# EAGLE design pavapro3c (EAGLE 6.4)
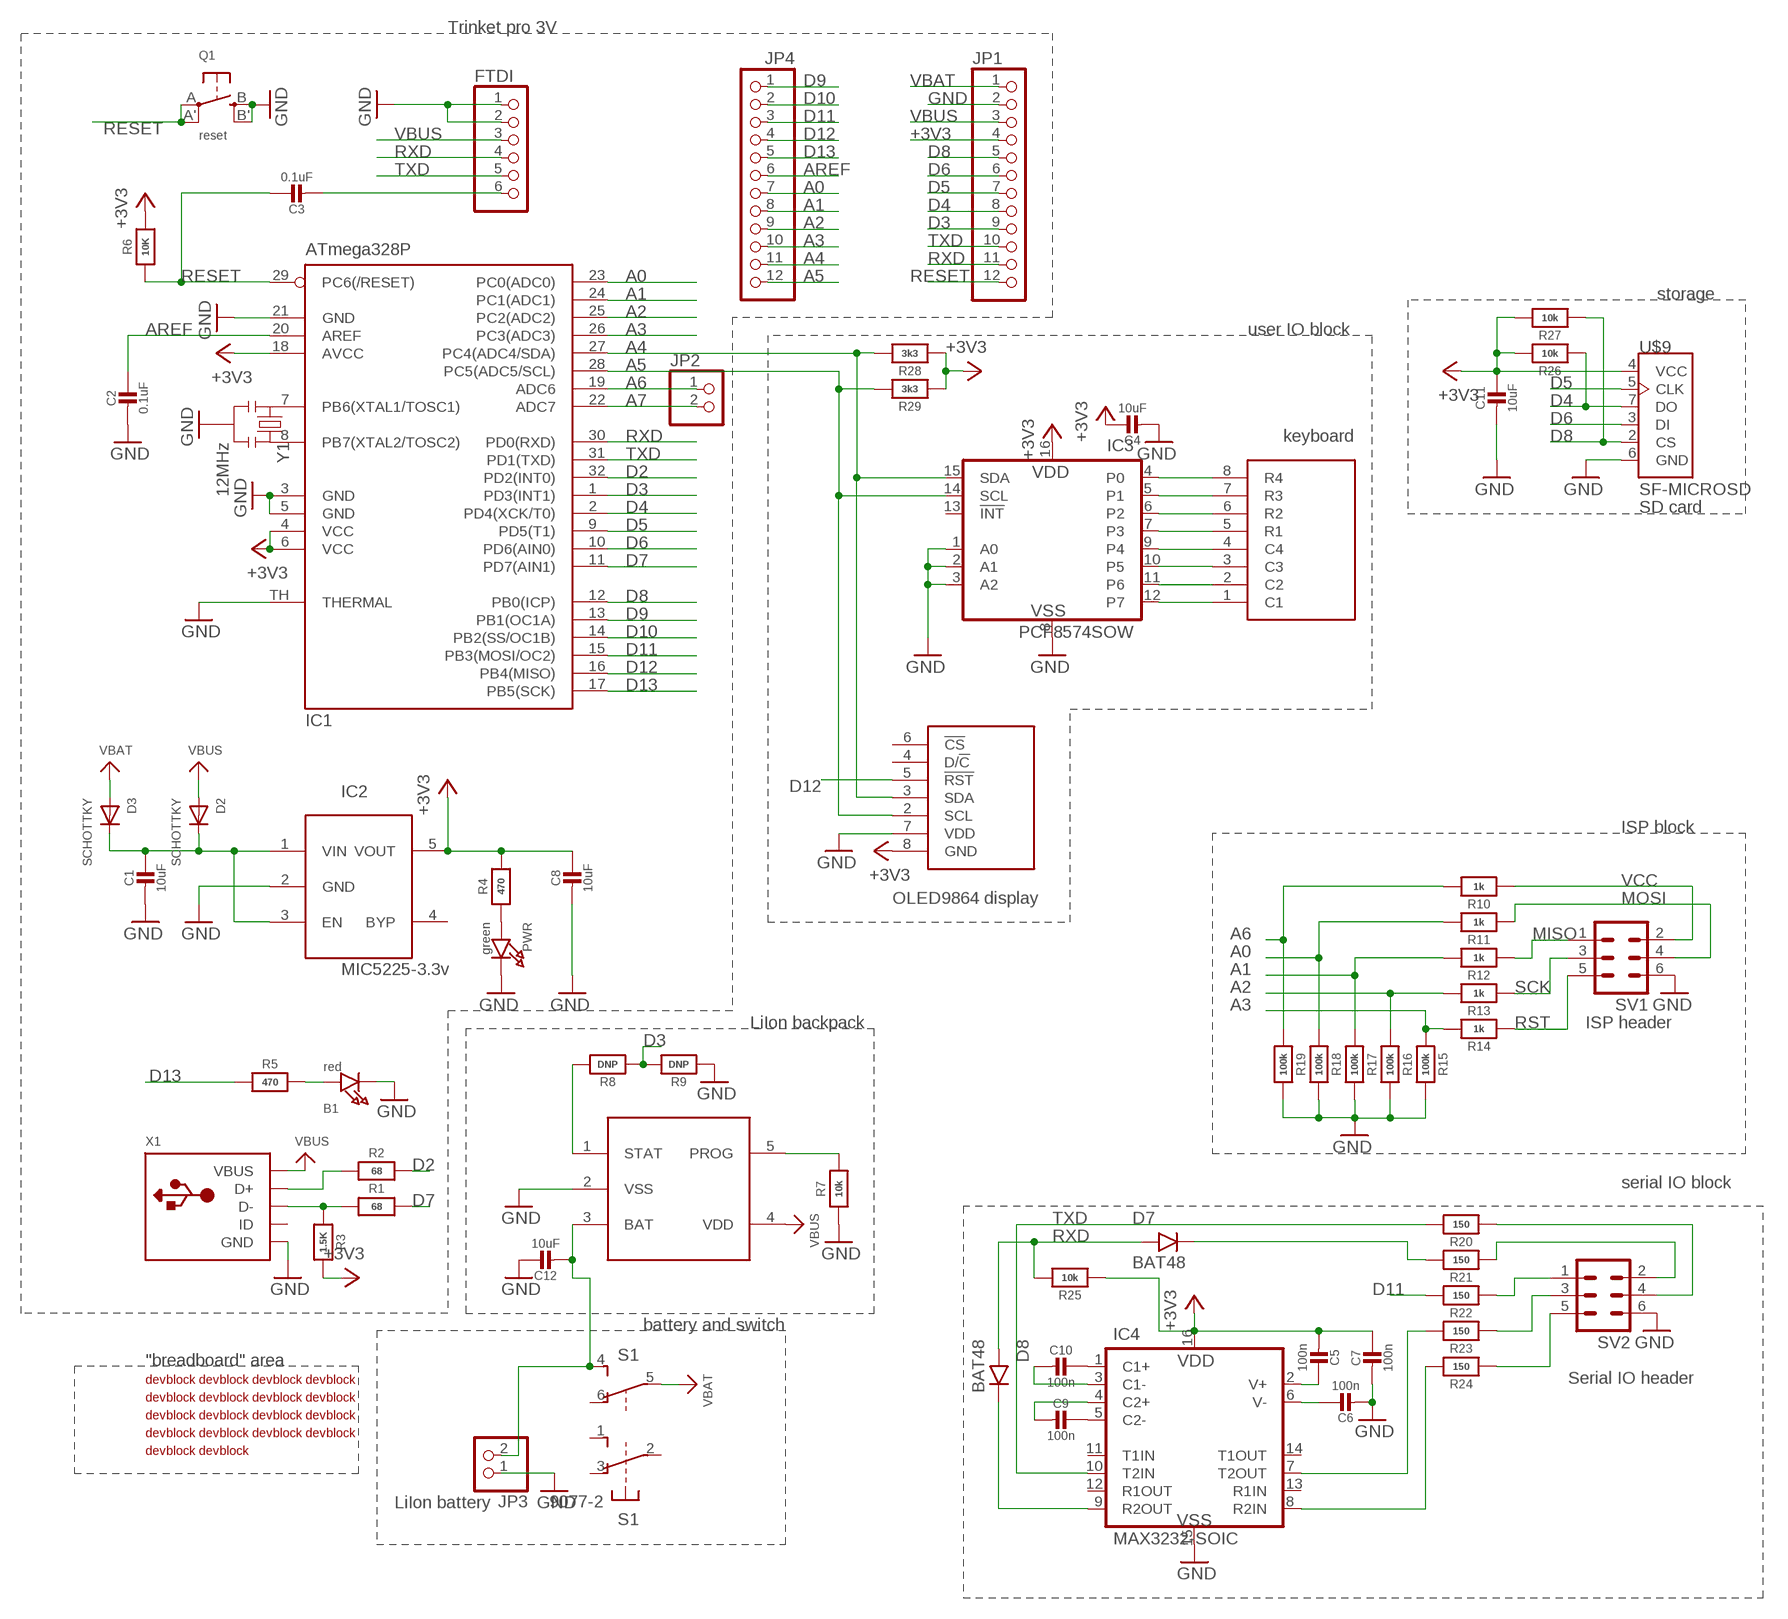
[diagram p0: schematic, sheet 1]

## Parts
B1  red  LED0805_NOOUTLINE  [CHIPLED_0805_NOOUTLINE]
C1  10uF  CAP_CERAMIC0805-NOOUTLINE  [0805-NO]
C2  0.1uF  CAP_CERAMIC_0805MP  [_0805MP]
C3  0.1uF  CAP_CERAMIC0805-NOOUTLINE  [0805-NO]
C4  10uF  CAP_CERAMIC0805-NOOUTLINE  [0805-NO]
C5  100n  CAP_CERAMIC0805-NOOUTLINE  [0805-NO]
C6  100n  CAP_CERAMIC0805-NOOUTLINE  [0805-NO]
C7  100n  CAP_CERAMIC0805-NOOUTLINE  [0805-NO]
C8  10uF  CAP_CERAMIC0805-NOOUTLINE  [0805-NO]
C9  100n  CAP_CERAMIC0805-NOOUTLINE  [0805-NO]
C10  100n  CAP_CERAMIC0805-NOOUTLINE  [0805-NO]
C11  10uF  CAP_CERAMIC0805-NOOUTLINE  [0805-NO]
C12  10uF  CAP_CERAMIC0805-NOOUTLINE  [0805-NO]
D2  SCHOTTKY  ADAFRUIT_DIODE_SOD-123FL  [ADAFRUIT_SOD-123FL]
D3  SCHOTTKY  ADAFRUIT_DIODE_SOD-123FL  [ADAFRUIT_SOD-123FL]
D7  BAT48  1N4148SOD  [SOD-80]
D8  BAT48  1N4148SOD  [SOD-80]
FTDI  ADAFRUIT_PINHD-1X6CB  [ADAFRUIT_1X06-CLEANBIG]
IC1  ATmega328P  MEGA8-MI  [MLF32-TH]
IC2  MIC5225-3.3v  LP298XS  [SOT23-5L]
IC3  PCF8574SOW  [SO-16DW]
IC4  MAX3232-SOIC  [SO-16]
JP1  ADAFRUIT_PINHD-1X12-CB  [ADAFRUIT_1X12-CB]
JP2  HEADER-1X2ROUND  [1X02_ROUND]
JP3  PINHD-1X02_2.54-90°  [1X02/90]
JP4  ADAFRUIT_PINHD-1X12-CB  [ADAFRUIT_1X12-CB]
PWR  green  LED0805_NOOUTLINE  [CHIPLED_0805_NOOUTLINE]
Q1  reset  SWITCH_TACT_SMT4.6X2.8  [BTN_KMR2_4.6X2.8]
R1  68  RESISTOR_0603_NOOUT  [0603-NO]
R2  68  RESISTOR_0603_NOOUT  [0603-NO]
R3  1.5K  RESISTOR_0603_NOOUT  [0603-NO]
R4  470  RESISTOR_0603_NOOUT  [0603-NO]
R5  470  RESISTOR_0603_NOOUT  [0603-NO]
R6  10K  RESISTOR0805_NOOUTLINE  [0805-NO]
R7  10k  RESISTOR_0805  [_0805]
R8  DNP  RESISTOR_0805  [_0805]
R9  DNP  RESISTOR_0805  [_0805]
R10  1k  RESISTOR_0805  [_0805]
R11  1k  RESISTOR_0805  [_0805]
R12  1k  RESISTOR_0805  [_0805]
R13  1k  RESISTOR_0805  [_0805]
R14  1k  RESISTOR_0805  [_0805]
R15  100k  RESISTOR_0805  [_0805]
R16  100k  RESISTOR_0805  [_0805]
R17  100k  RESISTOR_0805  [_0805]
R18  100k  RESISTOR_0805  [_0805]
R19  100k  RESISTOR_0805  [_0805]
R20  150  RESISTOR_0805  [_0805]
R21  150  RESISTOR_0805  [_0805]
R22  150  RESISTOR_0805  [_0805]
R23  150  RESISTOR_0805  [_0805]
R24  150  RESISTOR_0805  [_0805]
R25  10k  RESISTOR_0805  [_0805]
R26  10k  RESISTOR_0805  [_0805]
R27  10k  RESISTOR_0805  [_0805]
R28  3k3  RESISTOR_0805  [_0805]
R29  3k3  RESISTOR_0805  [_0805]
S1  9077-2  [9077-2]
SV1  ML6  [ML6]
SV2  ML6  [ML6]
U$5  DISP_OLED_2864  [OLED2864]
U$6  MCP73831  [SOT23-5]
U$7  KB1604  [KB1604]
U$9  SF-MICROSD  [MICROSD]
U$10  DEVBLOCK_1_16  [DEVBLOCK_1_16]
U$11  DEVBLOCK_1_16  [DEVBLOCK_1_16]
U$12  DEVBLOCK_1_16  [DEVBLOCK_1_16]
U$13  DEVBLOCK_1_16  [DEVBLOCK_1_16]
U$14  DEVBLOCK_1_16  [DEVBLOCK_1_16]
U$15  DEVBLOCK_1_16  [DEVBLOCK_1_16]
U$16  DEVBLOCK_1_16  [DEVBLOCK_1_16]
U$17  DEVBLOCK_1_16  [DEVBLOCK_1_16]
U$18  DEVBLOCK_1_16  [DEVBLOCK_1_16]
U$19  DEVBLOCK_1_16  [DEVBLOCK_1_16]
U$20  DEVBLOCK_1_16  [DEVBLOCK_1_16]
U$21  DEVBLOCK_1_16  [DEVBLOCK_1_16]
U$22  DEVBLOCK_1_16  [DEVBLOCK_1_16]
U$23  DEVBLOCK_1_16  [DEVBLOCK_1_16]
U$24  DEVBLOCK_1_16  [DEVBLOCK_1_16]
U$25  DEVBLOCK_1_16  [DEVBLOCK_1_16]
U$26  DEVBLOCK_1_16  [DEVBLOCK_1_16]
U$27  DEVBLOCK_1_16  [DEVBLOCK_1_16]
X1  MICROBUILDER_USBMICRO_20329  [MICROBUILDER_4UCONN_20329]
Y1  12MHz  RESONATORSMD  [RESONATOR-SMD]

## Nets
+3V3: C4.1 C5.2 C7.1 C8.1 C11.1 IC1.4(VCC) IC1.6(VCC) IC1.18(AVCC) IC2.5(VOUT) IC3.16(VDD) IC4.16(VDD) JP1.4 R3.2 R4.2 R6.2 R25.2 R26.1 R27.1 R28.2 R29.2 U$5.8(GND) U$9.4(VCC)
A0: IC1.23(PC0(ADC0)) JP4.7 R11.1 R18.2
A1: IC1.24(PC1(ADC1)) JP4.8 R12.1 R17.2
A2: IC1.25(PC2(ADC2)) JP4.9 R13.1 R16.2
A3: IC1.26(PC3(ADC3)) JP4.10 R14.1 R15.2
A4: IC1.27(PC4(ADC4/SDA)) IC3.15(SDA) JP4.11 R28.1 U$5.3(SDA)
A5: IC1.28(PC5(ADC5/SCL)) IC3.14(SCL) JP4.12 R29.1 U$5.2(SCL)
A6: IC1.19(ADC6) JP2.1 R10.1 R19.2
A7: IC1.22(ADC7) JP2.2
AREF: C2.1 IC1.20(AREF) JP4.6
D2: IC1.32(PD2(INT0)) R2.2
D3: IC1.1(PD3(INT1)) JP1.9 R8.2 R9.1
D4: IC1.2(PD4(XCK/T0)) JP1.8 R26.2 U$9.7(DO)
D5: IC1.9(PD5(T1)) JP1.7 U$9.5(CLK)
D6: IC1.10(PD6(AIN0)) JP1.6 U$9.3(DI)
D7: IC1.11(PD7(AIN1)) R1.2
D8: IC1.12(PB0(ICP)) JP1.5 R27.2 U$9.2(CS)
D9: IC1.13(PB1(OC1A)) JP4.1
D10: IC1.14(PB2(SS/OC1B)) JP4.2
D11: IC1.15(PB3(MOSI/OC2)) JP4.3 R22.1
D12: IC1.16(PB4(MISO)) JP4.4 U$5.5(!RST)
D13: IC1.17(PB5(SCK)) JP4.5 R5.2
D+: R2.1 X1.D+
D-: R1.1 R3.1 X1.D-
DTR/RTS: C3.2 FTDI.6
GND: B1.C C1.2 C2.2 C4.2 C6.2 C7.2 C8.2 C11.2 C12.1 FTDI.1 FTDI.2 IC1.3(GND) IC1.5(GND) IC1.21(GND) IC1.TH(THERMAL) IC2.2(GND) IC3.1(A0) IC3.2(A1) IC3.3(A2) IC3.8(VSS) IC4.15(VSS) JP1.2 JP3.1 PWR.C Q1.B'(S1) Q1.B(S) R7.2 R9.2 R15.1 R16.1 R17.1 R18.1 R19.1 SV1.6 SV2.6 U$5.7(VDD) U$6.2(VSS) U$9.6(GND) X1.BASE@1(GND) X1.BASE@2(GND) X1.GND X1.SPRT@1(GND) X1.SPRT@2(GND) X1.SPRT@3(GND) X1.SPRT@4(GND) Y1.2
MISO: R12.2 SV1.1
MOSI: R11.2 SV1.4
N$1: B1.A R5.1
N$2: IC1.8(PB7(XTAL2/TOSC2)) Y1.3
N$3: IC1.7(PB6(XTAL1/TOSC1)) Y1.1
N$6: PWR.A R4.1
N$7: C1.1 D2.C D3.C IC2.1(VIN) IC2.3(EN)
N$8: IC3.12(P7) U$7.1(C1)
N$9: IC3.11(P6) U$7.2(C2)
N$10: IC3.10(P5) U$7.3(C3)
N$11: IC3.9(P4) U$7.4(C4)
N$16: IC3.7(P3) U$7.5(R1)
N$17: IC3.6(P2) U$7.6(R2)
N$18: IC3.5(P1) U$7.7(R3)
N$19: IC3.4(P0) U$7.8(R4)
N$20: C12.2 JP3.2 S1.4(2:S) U$6.3(BAT)
N$26: R7.1 U$6.5(PROG)
N$28: R8.1 U$6.1(STAT)
N$37: R20.2 SV2.4
N$38: R21.2 SV2.2
N$39: R22.2 SV2.1
N$40: R23.2 SV2.3
N$41: R24.2 SV2.5
N$43: IC4.7(T2OUT) R23.1
N$44: D7.K R21.1
N$45: D8.K IC4.9(R2OUT)
N$47: C6.1 IC4.6(V-)
N$48: C5.1 IC4.2(V+)
N$50: C9.1 IC4.5(C2-)
N$51: C10.1 IC4.1(C1+)
N$52: C10.2 IC4.3(C1-)
N$53: C9.2 IC4.4(C2+)
N$54: IC4.8(R2IN) R24.1
RESET: C3.1 IC1.29(PC6(/RESET)) JP1.12 Q1.A'(P1) Q1.A(P) R6.1
RST: R14.2 SV1.5
RXD: D7.A D8.A FTDI.4 IC1.30(PD0(RXD)) JP1.11 R25.1
SCK: R13.2 SV1.3
TXD: FTDI.5 IC1.31(PD1(TXD)) IC4.10(T2IN) JP1.10 R20.1
VBAT [power]: D3.A JP1.1 S1.5(2:P)
VBUS: D2.A FTDI.3 JP1.3 U$6.4(VDD) X1.VBUS
VCC: R10.2 SV1.2
Unconnected: IC2.4(BYP) IC3.13(!INT) IC4.11(T1IN) IC4.12(R1OUT) IC4.13(R1IN) IC4.14(T1OUT) S1.1(1:S) S1.2(1:P) S1.3(1:O) S1.6(2:O) U$5.4(D/!C) U$5.6(!CS) X1.ID

## Notes on the sheet
- Trinket pro 3V
- storage
- user IO block
- keyboard
- SD card
- ISP block
- OLED9864 display
- LiIon backpack | ISP header
- serial IO block
- battery and switch
- "breadboard" area
- Serial IO header
- LiIon battery

## Library data of the parts
B1 PWR = microbuilder:LED: LED 0603 - 0603 Surface Mount Package 2mA: Green LED - Low Power (3.9mcd, 2ma, 1.7Vf) - Digikey: 475-2709-2-ND Orange LED - Low Power (9.8mcd, 2ma, 1.8Vf) - Digikey: 475-1194-2-ND Red LED - Low Power (5mcd, 2ma, 1.8Vf) - Digikey: 475-1195-2-ND Yellow LED - Low Power (7mcd, 2ma, 1.8Vf) - Digikey: 475-1196-2-ND 5mA: Blue LED - Low Power (17mcd, 5ma, 2.9Vf) - Digikey: LNJ937W8CRACT-ND 0805 - 0805 Surface Mount Package 2mA: Red LED (8.8mcd, 2mA, 1.8Vf, Clear) - Low Power [Digikey: 475-2510-1-ND] Green LED (5mcd, 2mA, 1.8Vf, Clear) - Low Power [Digikey: 475-2730-1-ND] Yellow LED (11.3mcd, 2mA, 1.8Vf, Clear) - Low Power [Digikey: 475-2555-1-ND] 20mA: Red LED (104mcd, 20mA, Diffused) - LS R976 [Digikey: 475-1278-6-ND] Red LED (12mcd, 20mA, 2.0Vf, Clear) - APT2012EC [Digikey: 754-1128-1-ND] Green LED (15mcd, 20mA, 2.2Vf, Clear) - APT2012GC [Digikey: 754-1131-1-ND] Orange LED (160mcd, 20mA, 2.1Vf, Clear) - APT2012SECK [Digikey: 754-1130-1-ND] 1206 - 1206 Surface Mount Package Green LED (26mcd, 20mA, Diffused) - LG N971 [Digikey: 475-1407-6-ND] Red LED (15mcd, 20mA, Diffused) - LH N974 [Digikey: 475-1416-6-ND] Cree - Cree High-Power Surface Mount LEDs XPEBWT-L1-0000-00D50 - White 111lm 350mA 2.9Vf 6200K 110° XTEAWT-00-0000-00000LEE3 - White 114lm 350mA 2.85Vf 5000K 115° Everlight - Everlight 45-21 Series Surface Mount LEDs 45-21/QK2C-B2832AC2CB2/2T - Warm White 2000mcd 20mA 3.25Vf 3050K 120° 45-21/LK2C-B38452C4CB2/2T - Nuetral White 2000mcd 20mA 3.25Vf 4150K 120° 45-21/LK2C-B50634C6CB2/2T - Cold White 2200mcd 20mA 3.25Vf 5650K 120° PLCC2 Reverse Mount LS T77K-J1L2-1-0-2-R18-Z - Red 11.25mcd 2mA 1.8Vf 630nm 120° LO T77K-L1M2-24-Z - Orange 19.6mcd 2mA 1.8Vf 606nm 120° LY T77K-K2M1-26-Z - Yellow 15.7mcd 2mA 1.8Vf 587nm 120°
C1-C12 = microbuilder:CAP_CERAMIC: Ceramic Capacitors For new designs, use the packages preceded by an '_' character since they are more reliable: The following footprints should be used on most boards: _0402 - Standard footprint for regular board layouts _0603 - Standard footprint for regular board layouts _0805 - Standard footprint for regular board layouts _1206 - Standard footprint for regular board layouts For extremely tight-pitch boards where space is at a premium, the following 'micro-pitch' footprints can be used (smaller pads, no silkscreen outline, etc.): _0402MP - Micro-pitch footprint for very dense/compact boards _0603MP - Micro-pitch footprint for very dense/compact boards _0805MP - Micro-pitch footprint for very dense/compact boards _1206MP - Micro-pitch footprint for very dense/compact boards
D2 D3 = Adafruit Pro Trinket 3v3:ADAFRUIT_DIODE: Diode SMADIODE - SMA Surface Mount Package 20V 1A Schottky Diode Digikey: 641-1014-6-ND DO-1N4148 - Through Hole Small Current Diode SOD-123 20V 1 A (.5mV Vf) Schottky Diode - Digikey: MBRX120TPMSCT-ND SOD-323 10V 570mA (.38mV Vf, 3ns) Schottky Diode - Digikey: ZLLS410CT-ND SOD-523 30V 30mA Schottky Diode (RB751S-40TE61) - Digikey: RB751S-40TE61CT-ND SOT23-R/W - SOT23 Package (R = Solder Paste/Reflow Ovens, W = Hand-Soldering) BAT54Film 40V 300mA - Digikey: 497-7162-1-ND
D7 D8 = _mcom5:1N4148
FTDI = Adafruit Pro Trinket 3v3:ADAFRUIT_PINHD-1X6: PIN HEADER
IC1 = microbuilder:MEGA8-MI: MICROCONTROLLER 8 Kbytes FLASH, 1 kbytes SRAM, 512 bytes EEPROM, USART, 6-channel 10 bit ADC, 2-channel 8 bit ADC Pin compatible with Atmega48, ATMega88, ATMega168 Source: avr.lbr; MPN: ATMEGA88PA-MU; OC_FARNELL: 1715491; OC_NEWARK: 15R0272
IC2 = adafruit:LP298X
IC3 = _mcom5:PCF8574
IC4 = _mcom5:MAX3232
JP1 JP4 = Adafruit Pro Trinket 3v3:ADAFRUIT_PINHD-1X12: PIN HEADER
JP2 = microbuilder:HEADER-1X2: PIN HEADER
JP3 = pinhead-2:PINHD-1X02: PIN HEADER
Q1 = microbuilder:SWITCH_TACT_SMT: SMT Tact Switches 6x6mm - Digikey: P12940SCT-ND KMR2 (4.6x2.8mm) - Digikey: 401-1426-1-ND EVQ-PQHB55 - Light Touch, 160GF (4.5x4.5mm) - Digikey: P8090SCT-ND KMT0 - KMT021 NGJ LHS (etc.) IP68/Waterproof - Digikey: CKN10289CT-ND
R1-R29 = microbuilder:RESISTOR: Resistors For new designs, use the packages preceded by an '_' character since they are more reliable: The following footprints should be used on most boards: _0402 - Standard footprint for regular board layouts _0603 - Standard footprint for regular board layouts _0805 - Standard footprint for regular board layouts _1206 - Standard footprint for regular board layouts For extremely tight-pitch boards where space is at a premium, the following 'micro-pitch' footprints can be used (smaller pads, no silkscreen outline, etc.): _0402MP - Micro-pitch footprint for very dense/compact boards _0603MP - Micro-pitch footprint for very dense/compact boards _0805MP - Micro-pitch footprint for very dense/compact boards _1206MP - Micro-pitch footprint for very dense/compact boards
S1 = switch-misc:9077-2: MARQUARDT SWITCH
SV1 SV2 = con-harting-ml:ML6: HARTING
U$5 = _moja:DISP_OLED_2864
U$6 = _moja:MCP73831
U$7 = _moja:KB1604
U$9 = microsd:SF-MICROSD
U$10-U$27 = _moja:DEVBLOCK
X1 = Adafruit Pro Trinket 3v3:MICROBUILDER_USB: USB Connectors USBMINIB - Surface Mount Female Mini-B USB Connector 4UConnector: 06564
Y1 = SparkFun:RESONATOR: Resonator Small SMD resonator. This is the itty bitty 10/20MHz resonators with built in caps. CSTCE10M0G55 and CSTCE20M0V53. Footprint has been reviewed closely but hasn't been tested yet.

## Net classes
1 power: width 0.305 mm

## Board
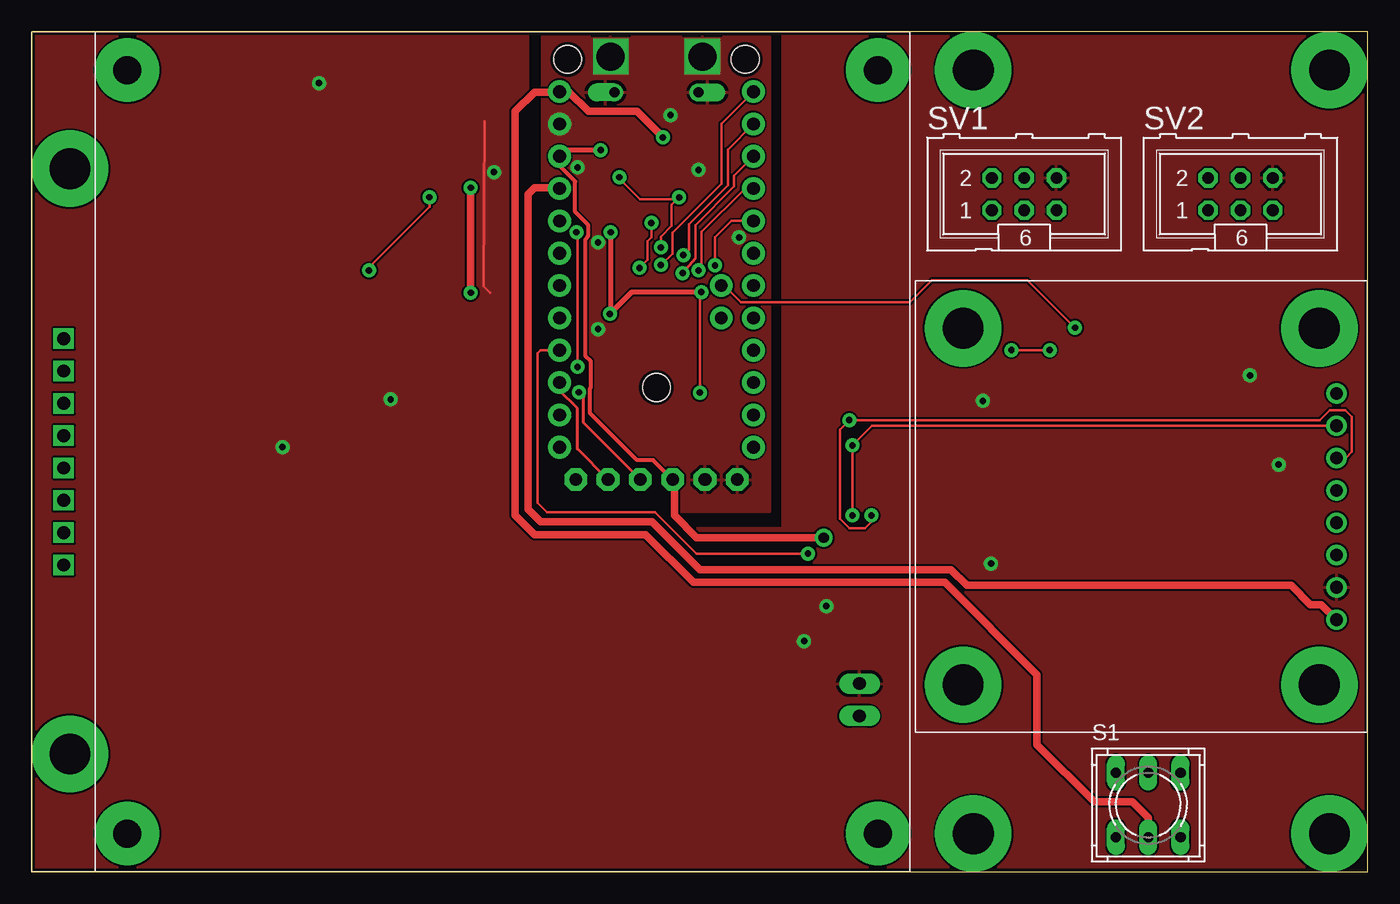
[diagram p1: board, top side]
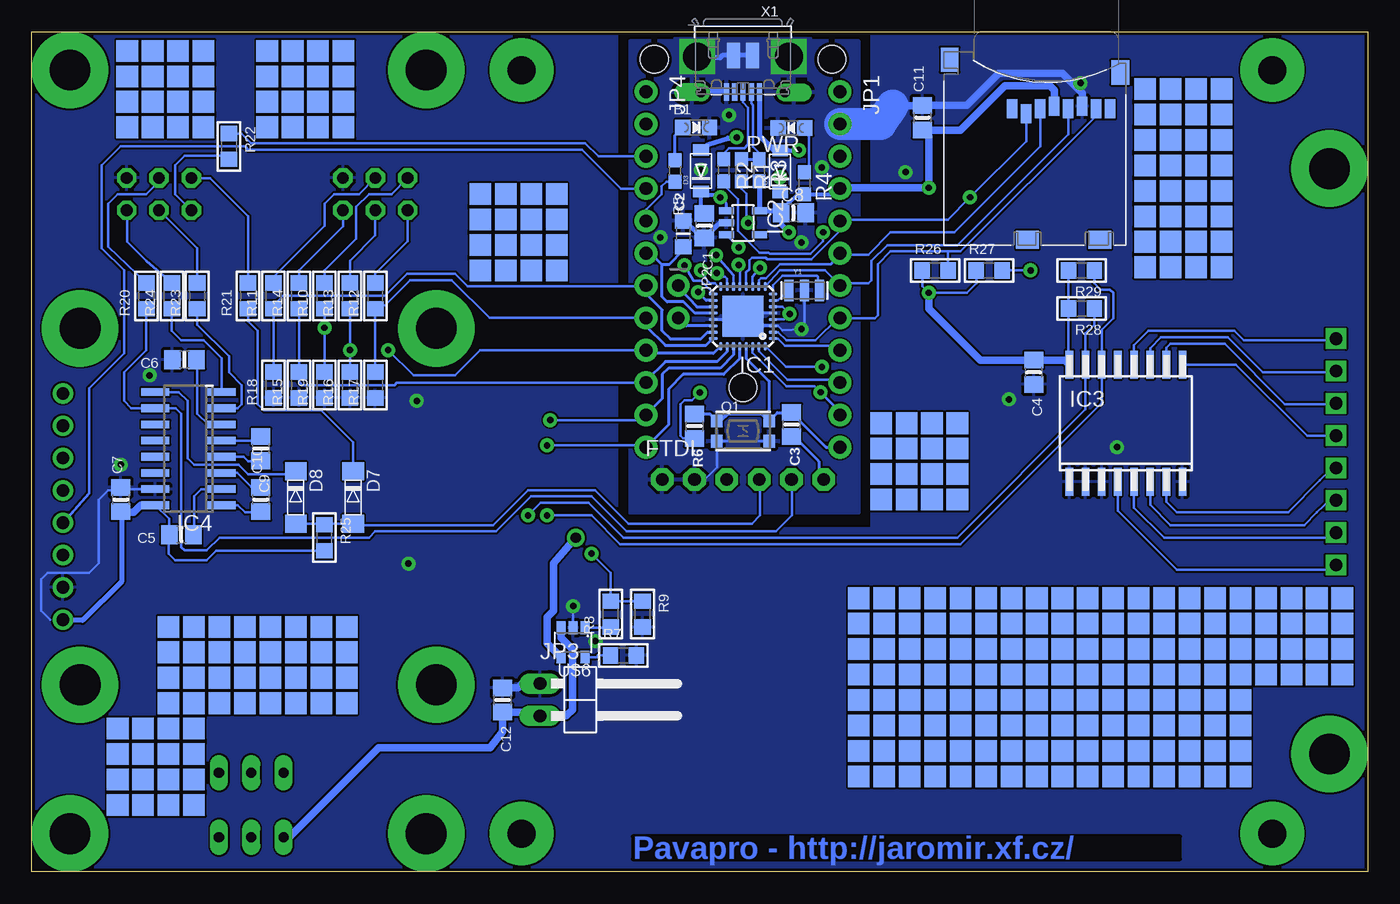
[diagram p2: board, bottom side, seen from below]

Size 105 x 66 mm. Coordinates in mm from the lower left corner, seen from the top.
Outline: 0,66 0,0 105,0 105,66 0,66
Copper layers (1*16): Top 0.035mm / dielectric 1.5mm / Bottom 0.035mm
Design rules "drirr": minimum track width 0.15mm, minimum drill 0.5mm, track to track 0.15mm, track to pad 0.15mm, pad to pad 0.15mm, via to via 0.15mm, smd to smd 0.15mm, copper to edge 10mil, drill to drill 8mil, minimum pad ring 0.3mm, minimum via ring 0.3mm, stop-mask expansion 4mil, vias tented up to drill 0mil, thermal gap 10mil
Holes 2.2 mm at 56.09,63.84 42.12,63.84 49.1,38.06

### Footprints (pad centres in the part's own frame; a part is rotated, then mirrored left to right if it is on the bottom)
CHIPLED_0805_NOOUTLINE = smd 1.2 x 1.2: A 0,-1.05; C 0,1.05
0805-NO = smd 1.3 x 1.5: 1 -0.95,0; 2 0.95,0
_0805MP = smd 1.2 x 1.3: 1 -1.016,0; 2 1.016,0
ADAFRUIT_SOD-123FL = smd 0.91 x 1.22: A 1.637,0; C -1.637,0
SOD-80 = smd 1.397 x 1.702: A 1.905,0; K -2.223,0
ADAFRUIT_1X06-CLEANBIG = drill 1 pad 1.778 octagon: 1 -6.35,0; 2 -3.81,0; 3 -1.27,0; 4 1.27,0; 5 3.81,0; 6 6.35,0
MLF32-TH = smd 0.7 x 0.25: 1 -2.35,1.75; 2 -2.35,1.25; 3 -2.35,0.75; 4 -2.35,0.25; 5 -2.35,-0.25; 6 -2.35,-0.75; 7 -2.35,-1.25; 8 -2.35,-1.75; 17 2.35,-1.75; 18 2.35,-1.25; 19 2.35,-0.75; 20 2.35,-0.25; 21 2.35,0.25; 22 2.35,0.75; 23 2.35,1.25; 24 2.35,1.75 | smd 0.25 x 0.7: 9 -1.75,-2.35; 10 -1.25,-2.35; 11 -0.75,-2.35; 12 -0.25,-2.35; 13 0.25,-2.35; 14 0.75,-2.35; 15 1.25,-2.35; 16 1.75,-2.35; 25 1.75,2.35; 26 1.25,2.35; 27 0.75,2.35; 28 0.25,2.35; 29 -0.25,2.35; 30 -0.75,2.35; 31 -1.25,2.35; 32 -1.75,2.35 | smd 3.2 x 3.2: TH 0,0
SOT23-5L = smd 0.55 x 1.2: 1 -0.95,-1.3; 2 0,-1.3; 3 0.95,-1.3; 4 0.95,1.3; 5 -0.95,1.3
SO-16DW = smd 0.6 x 2.2: 1 -4.445,-4.6; 2 -3.175,-4.6; 3 -1.905,-4.6; 4 -0.635,-4.6; 5 0.635,-4.6; 6 1.905,-4.6; 7 3.175,-4.6; 8 4.445,-4.6; 9 4.445,4.6; 10 3.175,4.6; 11 1.905,4.6; 12 0.635,4.6; 13 -0.635,4.6; 14 -1.905,4.6; 15 -3.175,4.6; 16 -4.445,4.6
SO-16 = smd 0.6 x 2.2: 1 -4.445,-2.917; 2 -3.175,-2.917; 3 -1.905,-2.917; 4 -0.635,-2.917; 5 0.635,-2.917; 6 1.905,-2.917; 7 3.175,-2.917; 8 4.445,-2.917; 9 4.445,2.283; 10 3.175,2.283; 11 1.905,2.283; 12 0.635,2.283; 13 -0.635,2.283; 14 -1.905,2.283; 15 -3.175,2.283; 16 -4.445,2.283
ADAFRUIT_1X12-CB = drill 1 pad 1.778: 1 -13.97,0; 2 -11.43,0; 3 -8.89,0; 4 -6.35,0; 5 -3.81,0; 6 -1.27,0; 7 1.27,0; 8 3.81,0; 9 6.35,0; 10 8.89,0; 11 11.43,0; 12 13.97,0
1X02_ROUND = drill 1 pad 1.778: 1 -1.27,0; 2 1.27,0
1X02/90 = drill 1 long: 1 -2.54,-3.81; 2 0,-3.81
BTN_KMR2_4.6X2.8 = smd 0.9 x 1: A 2.05,0.8; A' -2.05,0.8; B 2.05,-0.8; B' -2.05,-0.8
0603-NO = smd 1.1 x 1: 1 -0.85,0; 2 0.85,0
_0805 = smd 1.2 x 1.3: 1 -1.016,0; 2 1.016,0
9077-2 = drill 0.8 long: 1 -2.54,2.54; 2 0,2.54; 3 2.54,2.54; 4 -2.54,-2.54; 5 0,-2.54; 6 2.54,-2.54
ML6 = drill 0.914 octagon: 1 -2.54,-1.27; 2 -2.54,1.27; 3 0,-1.27; 4 0,1.27; 5 2.54,-1.27; 6 2.54,1.27
OLED2864 = drill 1: 1 8.86,33.1; 2 11.4,33.1; 3 13.94,33.1; 4 16.48,33.1; 5 19.02,33.1; 6 21.56,33.1; 7 24.1,33.1; 8 26.64,33.1 | drill 3.2 pad 6: P$1 3.75,3.75; P$2 31.75,3.75; P$3 3.75,31.75; P$4 31.75,31.75
SOT23-5 = smd 0.7 x 1: 1 -0.99,-1.17; 2 -0.04,-1.17; 3 0.91,-1.17; 4 0.91,1.13; 5 -0.99,1.13
KB1604 = drill 1 square: 1 -8.89,-2.5; 2 -6.35,-2.5; 3 -3.81,-2.5; 4 -1.27,-2.5; 5 1.27,-2.5; 6 3.81,-2.5; 7 6.35,-2.5; 8 8.89,-2.5 | drill 2.2 pad 5: P$2 -30,2.5; P$3 30,2.5; P$4 -30,61.5; P$5 30,61.5
MICROSD = smd 0.8 x 1.5: 1 -1.94,2.7; 2 -0.84,2.3; 3 0.26,2.7; 4 1.36,2.9; 5 2.46,2.7; 6 3.56,2.9; 7 4.66,2.7; 8 5.76,2.7 | smd 1.4 x 1.9: NC -6.85,6.55; NC3 6.55,5.55 | smd 1.8 x 1.4: NC1 -0.75,-7.6; NC2 4.95,-7.6
DEVBLOCK_1_16 = smd 1.7 x 1.7: P$1 -1,1; P$2 1,1; P$3 1,-1; P$4 -1,-1; P$5 -3,-1; P$6 -3,1; P$7 -3,3; P$8 -1,3; P$9 1,3; P$10 3,3; P$11 3,1; P$12 3,-1; P$13 3,-3; P$14 1,-3; P$15 -1,-3; P$16 -3,-3
MICROBUILDER_4UCONN_20329 = smd 1 x 2: BASE@1 -0.75,-2; BASE@2 0.75,-2 | smd 0.4 x 1.35: D+ 0,0.875; D- -0.65,0.875; GND 1.3,0.875; ID 0.65,0.875; VBUS -1.3,0.875 | drill 0.8 offset: SPRT@1 -3.3,0.9; SPRT@2 3.3,0.9 | drill 2.2 pad 2.7 square: SPRT@3 -3.6,-1.9; SPRT@4 3.6,-1.9
RESONATOR-SMD = smd 0.7 x 1.7: 1 -1.2,0; 2 0,0; 3 1.2,0

### Placement (x,y rotation side)
B1  52.78,58.48 270 bottom
C1  52.15,50.76 270 bottom
C2  53.8,50.12 90 bottom
C3  45.29,35.14 270 bottom
C4  26.25,39.25 270 bottom
C5  93.25,26.5 180 bottom
C6  93,40.25 180 bottom
C7  98,29.25 90 bottom
C8  45.14,51.77 0 bottom
C9  87,33.25 270 bottom
C10  87,29.25 90 bottom
C11  35,59.25 90 bottom
C12  68,13.5 270 bottom
D2  46.18,55.03 90 bottom
D3  52.4,55.08 90 bottom
D7  79.75,29.25 270 bottom
D8  84.25,29.25 270 bottom
FTDI  49.1,30.82 0 bottom
IC1  49.1,43.65 180 bottom
IC2  49.1,50.99 270 bottom
IC3  19,35.25 0 bottom
IC4  93,33.25 90 bottom
JP1  41.48,47.33 270 bottom
JP2  54.18,44.79 270 bottom
JP3  61.25,12.25 270 bottom
JP4  56.72,47.33 270 bottom
PWR  45.29,58.44 90 bottom
Q1  49.1,34.63 0 bottom
R1  49.23,55.12 270 bottom
R2  50.62,55.12 270 bottom
R3  47.83,55.12 270 bottom
R4  44.27,54.1 270 bottom
R5  54.45,55.08 270 bottom
R6  52.91,35.01 270 bottom
R7  58.5,17 0 bottom
R8  59.5,20.25 90 bottom
R9  57,20.25 270 bottom
R10  82,45.25 90 bottom
R11  86,45.25 90 bottom
R12  78,45.25 90 bottom
R13  80,45.25 90 bottom
R14  84,45.25 90 bottom
R15  84,38.25 90 bottom
R16  80,38.25 90 bottom
R17  78,38.25 90 bottom
R18  86,38.25 90 bottom
R19  82,38.25 90 bottom
R20  96,45.25 90 bottom
R21  88,45.25 90 bottom
R22  89.5,57 270 bottom
R23  92,45.25 90 bottom
R24  94,45.25 90 bottom
R25  82,26.25 270 bottom
R26  34,47.25 0 bottom
R27  29.75,47.25 0 bottom
R28  22.5,44.25 180 bottom
R29  22.5,47.25 180 bottom
S1  87.75,5.25 0 top
SV1  78,53.25 0 top
SV2  95,53.25 0 top
U$5  69.45,46.45 270 top
U$6  62.5,18 180 bottom
U$7  5,33 270 top
U$9  26,57.25 0 bottom
U$10  83.25,16.25 0 bottom
U$11  91.25,16.25 0 bottom
U$12  14.5,58.5 0 bottom
U$13  14.5,50.5 0 bottom
U$14  35.25,32.25 0 bottom
U$15  5,18.5 0 bottom
U$16  13,18.5 0 bottom
U$17  21,18.5 0 bottom
U$18  94.5,61.5 0 bottom
U$19  83.5,61.5 0 bottom
U$20  29,18.5 0 bottom
U$21  37,18.5 0 bottom
U$22  37,10.5 0 bottom
U$23  66.75,50.25 0 bottom
U$24  29,10.5 0 bottom
U$25  21,10.5 0 bottom
U$26  13,10.5 0 bottom
U$27  95.25,8.25 0 bottom
X1  49.1,62.15 180 bottom
Y1  44.28,45.68 0 bottom

### Tracks (layer width: path | path; a pad name or v marks a point on that pad's centre or on a via)
+3V3  (via drill 0.5)
  Top 0.18: v52.5,37.65 52.5,45.42 v52.63,45.55
  Top 0.4: v52.63,45.55 47.16,45.55 v45.44,43.83 45.5,44 v45.5,50.25
  Top 0.6: JP1.4 41.3,53.75 39.5,53.75 39,53.25 39,28.5 40,27.5 48.75,27.5 52.5,23.75 72.25,23.75 73.5,22.5 99,22.5 100.5,21 101.36,21 U$5.8 | v34.5,53.75 v34.5,45.5
  Bottom 0.18: IC1.4 45.87,43.4 v45.44,43.83 46,44.4 IC1.6 | R6.2 53.81,34.06 54,34.25 54,36.75 53.7,37.05 53.1,37.05 v52.5,37.65
  Bottom 0.2: 97.95,28.25 C7.1 | 41,53.75 41.08,53.83 | R27.1 30.77,46.23 31.5,45.5 v34.5,45.5 35.02,46.02 R26.1 | R25.2 90.52,25.23 91.25,24.5 93.75,24.5 94.25,25 94.25,26.45 C5.2 94.2,27.72 IC4.16 | 23.8,40.2 23.52,40.48 R28.2 R29.2
  Bottom 0.254: IC1.18 52,44.9 52.53,45.42
  Bottom 0.3: 46.25,51.93 C8.1 45.6,52.26 45.6,52.45 44.8,53.25 R4.2 | 44.2,53.25 41.91,53.25 JP1.4
  Bottom 0.305: 52.53,45.42 v52.63,45.55
  Bottom 0.4: 47.8,53.94 IC2.5 | R4.2 44.2,53.25 | C8.1 46.09,50.84 v45.5,50.25 | 47.7,51.93 46.25,51.93 | 97.95,28.25 97.95,22.8 101,19.75 102.49,19.75 U$5.8
  Bottom 0.406: 47.7,51.93 IC2.5 | R3.2 47.8,53.94
  Bottom 0.6: 41.08,53.83 JP1.4 | U$9.4 24.64,61.39 25,61.75 28.5,61.75 32,58.25 34.95,58.25 C11.1 34.7,58.3 34.5,57.75 v34.5,53.75 41,53.75 | IC4.16 96.44,28.8 97,28.25 97.95,28.25 | IC3.16 23.8,40.2 C4.1 30.45,40.2 34.5,44.25 v34.5,45.5
A0
  Bottom 0.2: R18.2 R11.1 86,44.5 85.25,45.25 77.25,45.25 75.5,47 71.75,47 70.75,46 56.78,46 JP4.7
  Bottom 0.254: IC1.23 51.87,42.4 52.4,41.87 54.81,41.87 55.45,42.5 55.45,44.16 56.72,45.42 JP4.7
A1
  Bottom 0.2: R17.2 R12.1 77.9,44.5 77.25,44.5 75.25,46.5 72,46.5 69.02,43.52 JP4.8
  Bottom 0.254: JP4.8 56.72,42.88 55.2,41.36 52.02,41.36 51.48,41.9 IC1.24
A2  (via drill 0.5)
  Top 0.2: v77,41 v80,41
  Bottom 0.2: R13.1 v80,41 R16.2 | JP4.9 69.77,40.98 71.75,39 75,39 v77,41
  Bottom 0.254: 50.85,41.13 IC1.25 51.42,40.73 56.47,40.73 JP4.9
A3
  Bottom 0.2: R14.1 R15.2 84,38.5 83.75,38.25 76.5,38.25 76.31,38.44 JP4.10
  Bottom 0.254: JP4.10 56.72,38.57 55.2,40.09 51.13,40.09 50.35,40.87 IC1.26
A4  (via drill 0.5)
  Top 0.2: U$5.3 103.26,32.51 103.75,33 103.75,35.75 103.25,36.25 102,36.25 101.25,35.5 v64.25,35.5 63.5,34.75 63.5,27.75 64.25,27 65.5,27 66,27.5 v66,28
  Bottom 0.2: v64.25,35.5 57.12,35.5 JP4.11 | v66,28 65,29 61.25,29 58.5,26.25 32.25,26.25 22.18,36.33 IC3.15 22.18,42.33 21.5,43 21.5,44.23 R28.1
  Bottom 0.254: JP4.11 55.45,37.17 55.45,39.08 54.94,39.58 50.88,39.58 49.85,40.61 IC1.27
A5  (via drill 0.5)
  Top 0.2: U$5.2 66.05,35.05 v64.5,33.5 v64.5,28
  Bottom 0.2: v64.5,33.5 56.86,33.5 JP4.12 | v64.5,28 61,28 58.75,25.75 32,25.75 20.91,36.84 IC3.14 20.91,42.59 20,43.5 20,45.5 20.25,45.75 21,45.75 21.48,46.23 R29.1
  Bottom 0.254: IC1.28 49.35,40.35 50.62,39.08 53.8,39.08 54.94,37.93 54.94,35.14 JP4.12
A6  (via drill 0.5)
  Top 0.2: JP2.1 54.44,46.06 55.75,44.75 69,44.75 70.75,46.5 78.25,46.5 v82,42.75
  Bottom 0.2: R10.1 v82,42.75 R19.2
  Bottom 0.254: JP2.1 54.18,45.93 54.1,45.85 52.72,44.4 IC1.19
A7
  Bottom 0.254: IC1.22 53.56,42.9 JP2.2
AREF
  Bottom 0.254: IC1.20 52.88,43.9 53.77,44.79 55.07,44.79 55.45,45.17 55.45,47.71 | 55.45,47.71 56.34,48.6 JP4.6 | 55.45,47.71 54.9,47.71 53.76,48.89 C2.1
D2  (via drill 0.5)
  Top 0.18: v42.89,39.67 42.89,50.16 v42.8,50.25
  Bottom 0.18: v42.89,39.67 45.73,39.67 IC1.32 | R2.2 50.62,53.97 49.5,52.85 49.5,50.35 47.8,48.65 47.1,48.65 47,48.55 43.8,48.55 42.8,49.55 v42.8,50.25
D3  (via drill 0.5)
  Top 0.2: v61,25 52.25,25 49,28.25 40.5,28.25 39.75,29 39.75,40.75 40,41 41.46,41 JP1.9
  Bottom 0.18: IC1.1 46.35,41.9 45.8,41.35 41.85,41.35 JP1.9
  Bottom 0.2: v61,25 59.5,23.5 R8.2 R9.1
D4
  Bottom 0.18: IC1.2 46.35,42.4 45.7,41.75 43.4,41.75 41.6,43.55 41.51,43.55 JP1.8
  Bottom 0.2: U$9.7 21.34,59.41 32,48.75 33,48.75 | 33,48.75 37.5,48.75 38.5,47.75 38.5,43.75 38.75,43.5 41.46,43.5 JP1.8 | R26.2 32.98,48.73 33,48.75
D5
  Bottom 0.18: IC1.9 46.2,47.25 42.67,47.25 JP1.7
  Bottom 0.2: U$9.5 23.54,57.96 32.25,49.25 37.75,49.25 39,48 39,46.5 39.25,46.25 41.29,46.25 JP1.7
D6
  Bottom 0.18: JP1.6 42.2,47.75 46.2,47.75 47.3,46.65 47.7,46.65 47.85,46.5 IC1.10
  Bottom 0.2: U$9.3 25.74,57.01 32.5,50.25 37.5,50.25 39.25,48.5 41.38,48.5 JP1.6
D7  (via drill 0.5)
  Top 0.18: v48.7,50.99 v48.7,50.98 48.7,49.85 48.4,49.55 48.4,48.09 v47.77,47.46
  Bottom 0.18: R1.2 49.23,53.67 48.85,53.29 48.85,51.13 v48.7,50.99 | IC1.11 48.35,46.77 v47.77,47.46
D8  (via drill 0.5)
  Top 0.2: v26.5,47.25 26.5,47.5 31.25,52.25 v31.25,53
  Bottom 0.18: IC1.12 48.85,47.1 48.6,47.35 48.6,48.05 48.4,48.25 47.3,48.25 47.2,48.15 43.7,48.15 41.5,50.35 41.5,51.12 JP1.5
  Bottom 0.2: U$9.2 26.84,57.41 v31.25,53 33,51.25 41.37,51.25 JP1.5 | R27.2 v26.5,47.25
  Bottom 0.254: JP1.5 41.48,50.76
D9  (via drill 0.5)
  Top 0.18: v49.44,47.68 50.34,48.58 50.34,50.19 54.2,54.05 54.2,58.78 JP4.1
  Bottom 0.18: IC1.13 49.35,47.59 v49.44,47.68
D10  (via drill 0.5)
  Top 0.18: v51.22,48.46 51.64,48.88 51.64,50.89 54.7,53.95 54.7,56.74 JP4.2
  Bottom 0.18: IC1.14 49.85,46.89 v51.22,48.46
D11  (via drill 0.5)
  Top 0.18: v51.16,47.04 52.15,48.23 52.15,50.8 55.2,53.85 55.2,54.7 JP4.3
  Bottom 0.18: IC1.15 50.35,46.6 50.5,46.75 50.87,46.75 v51.16,47.04
  Bottom 0.2: JP4.3 60.47,56.22 61.5,57.25 87.75,57.25 88.5,58 89.15,58 R22.1
D12  (via drill 0.5)
  Top 0.18: v52.4,47.25 52.66,47.51 52.66,50.31 56,53.65 56.69,53.65 JP4.4
  Bottom 0.18: IC1.16 51.05,46 51.3,46.25 51.7,46.25 52.1,46.65 52.1,46.95 v52.4,47.25
  Bottom 0.2: JP4.4 58.68,53.68 61.75,56.75 88,56.75 88.25,57 98,57 99.5,55.5 99.5,49 97.75,47.25 97.75,40.75 100.5,38 100.5,29.73 U$5.5
D13  (via drill 0.5)
  Top 0.18: v53.7,47.65 53.7,49.85 55,51.15 JP4.5
  Bottom 0.18: v53.7,47.65 53,46.45 52.4,46.45 51.45,45.5 IC1.17 | R5.2 55.12,54.23 55.5,53.85 55.5,53.25 56.7,52.05 56.7,51.16 JP4.5
D+
  Bottom 0.18: X1.D+ 49.1,60.45 48.7,60.05 48.7,57.15 49,56.85 50.2,56.85 50.6,56.45 50.6,56 R2.1
D-
  Bottom 0.18: X1.D- 48.45,60.4 48.3,60.25 48.3,56.95 47.8,56.45 47.8,56 R3.1
  Bottom 0.254: R1.1 R3.1
DTR/RTS
  Bottom 0.254: FTDI.6 43.13,31.2 43.13,32.26 45.06,34.19 C3.2
GND  (via drill 0.5)
  Top 0.2: 36,45.5 35.5,46 35.58,58.98
  Bottom 0.18: Y1.2 44.28,42.87 v44.5,42.65 | 44.6,42.55 v44.5,42.65 | IC1.3 46.35,42.9 46,42.55 v44.5,42.65
  Bottom 0.2: 49.35,43.4 IC1.TH | 48.85,43.9 IC1.TH | 48.35,42.9 IC1.TH | FTDI.2 52.88,30.85 52.1,30.85 51.15,31.8 Q1.B' Q1.B | IC1.TH | 103.56,19.81 104.25,20.5 104.25,23 103.75,23.5 100.5,23.5 99.75,24.25 99.75,29.25 99,30 98.2,30 C7.2 97.88,30.07 IC4.15 | U$6.2 62.46,20.86
  Bottom 0.25: IC1.21 49.35,43.4 | IC1.5 48.85,43.9 | IC1.3 48.35,42.9
  Bottom 0.4: C2.2 53.78,51.14 C1.2 50.87,50.99 IC2.2 | X1.GND 52.38,61.27 X1.SPRT@2 | X1.BASE@1 X1.BASE@2 50.7,64.15 50.9,63.95 52.6,63.95 X1.SPRT@4
  Bottom 0.6: U$9.6 22.44,61.19 24,62.75 29,62.75 31.5,60.25 34.95,60.25 C11.2 36.7,60.2 37.33,60.23 | C12.1 66.8,14.45 66.5,14.75 65.1,14.75 JP3.1
  Bottom 2.5: JP1.2 38.29,58.76 37.33,60.23
  other vias: 55.6,49.85 50.2,59.45 42.9,55.35 44.5,49.45 52.4,55.15 75.4,24.23 95.75,39 74.75,37 98,32 62.45,20.88 28.2,37.12 19.7,33.38 22.57,61.98 36.33,54.98 60.7,18.12
  pour Top: 58,65.65 58,28.25 40.1,28.25 40.1,65.65
  pour Bottom: 58,28.25 40,28.25 40,65.25 58,65.25
  pour Top: 0,0 105,0 105,66 59,66 59,27 39,27 39,66 0,66
  pour Bottom: 0,0 105,0 105,66 59,66 59,27 39,27 39,66 0,66
  pour Top (no thermals): 40.25,60 40.25,57.5 42.5,57.5 42.5,60
  pour Bottom (no thermals): 43.75,65.5 43.75,62.5 54.5,62.5 54.5,65.5
  pour Top (no thermals): 43.75,65.5 43.75,62.5 54.5,62.5 54.5,65.5
MISO
  Bottom 0.2: SV1.1 75.46,49.54 78,47 R12.2
MOSI
  Bottom 0.2: R11.2 86,46.75 82,50.75 82,52.5 81.25,53.25 79.27,53.25 SV1.4
N$1
  Bottom 0.254: R5.1 54.45,57.86 B1.A
N$2
  Bottom 0.18: IC1.8 46.75,46.1 46,46.85 43.3,46.85 43.2,46.75 43.2,45.7 Y1.3
N$3
  Bottom 0.18: IC1.7 46.36,44.9 Y1.1
N$4  (via drill 3.2 pad 6)
  other vias: 74,3
N$5  (via drill 3.2 pad 6)
  other vias: 74,63
N$6
  Bottom 0.18: PWR.A 44.24,58.09 43.9,57.75 43.9,55.43 R4.1
N$7  (via drill 0.5)
  Top 0.18: v49.44,49.06 49.44,49.89 50.3,50.75 50.3,52.41 v50.88,52.99 50.74,52.85 47.8,52.85 46.18,54.47 v46.18,54.57
  Bottom 0.18: IC2.3 50.31,49.94 v49.44,49.06
  Bottom 0.254: IC2.1 50.4,52.51 v50.88,52.99 | D2.C 46.05,53.26 46.18,53.17 v46.18,54.57 | 52.27,53.19 52.4,53.31 D3.C
  Bottom 0.305: C1.1 52.4,51.96 D3.C | 52.27,53.19 51.18,53.19 v50.88,52.99
N$8
  Bottom 0.2: IC3.12 18.36,41.38 17.25,42.5 10.5,42.5 9.75,41.75 2.64,41.75 U$7.1
N$9
  Bottom 0.2: IC3.11 17.09,41.16 16.25,42 11,42 8.25,39.25 2.6,39.25 U$7.2
N$10
  Bottom 0.2: IC3.10 15.82,41.17 15.5,41.5 11.25,41.5 6.5,36.75 2.56,36.75 U$7.3
N$11
  Bottom 0.2: IC3.9 10.35,39.85 4.75,34.25 2.52,34.25 U$7.4
N$16
  Bottom 0.2: IC3.7 15.82,29.07 15,28.25 6.25,28.25 3.75,30.75 2.98,31.5 U$7.5
N$17
  Bottom 0.2: IC3.6 17.09,28.84 15.5,27.25 5,27.25 4,28.25 2.94,29.25 U$7.6
N$18
  Bottom 0.2: IC3.5 18.36,28.61 16,26.25 2.9,26.25 U$7.7
N$19
  Bottom 0.2: IC3.4 19.64,28.39 15,23.75 2.86,23.75 U$7.8
N$20
  Bottom 0.6: S1.4 84.79,2.71 77.75,9.75 69,9.75 68,11 C12.2 65.36,12.55 JP3.2 63,12.25 62.5,12.75 62.5,17.5 63.41,18.41 U$6.3
N$21  (via drill 3.2 pad 6)
  other vias: 3,9.25
N$22  (via drill 3.2 pad 6)
  other vias: 3,55.25
N$23  (via drill 3.2 pad 6)
  other vias: 102,3
N$24  (via drill 3.2 pad 6)
  other vias: 102,63
N$26
  Bottom 0.2: U$6.5 60.63,16.87 60.5,17 R7.1
N$28
  Bottom 0.2: U$6.1 59.56,19.17 R8.1
N$37
  Bottom 0.2: SV2.4 95,54.25 96,53.25 98.25,53.25 99,52.5 99,49.1 R20.2
N$38
  Bottom 0.2: R21.2 88,51.5 91,54.5 92.44,54.5 SV2.2
N$39
  Bottom 0.2: SV2.1 92.48,51.98 93.75,53.25 93.75,55.5 93,56.25 89.6,56.25 R22.2
N$40
  Bottom 0.2: R23.2 92,48.98 SV2.3
N$41
  Bottom 0.2: R24.2 96,48 97.5,49.5 97.5,51.94 SV2.5
N$43
  Bottom 0.2: IC4.7 88.83,36.42 88.5,36.75 88.5,38.25 89.5,39.25 89.5,40.5 92,43 R23.1
N$44
  Bottom 0.2: D7.K 79.75,33.75 82.25,36.25 86.75,36.25 87.25,36.75 87.25,42.5 88,43.25 R21.1
N$45
  Bottom 0.2: IC4.9 93.44,37.7 92.75,37 92.75,32.5 92.25,32 88.75,32 88,31.25 84.22,31.25 D8.K 83.97,31.5
N$47
  Bottom 0.2: IC4.6 91.16,35.16 92,36 92,40.2 C6.1
N$48
  Bottom 0.2: IC4.2 91.67,30.07 92.25,29.5 92.25,26.55 C5.1
N$50
  Bottom 0.2: IC4.5 87.31,33.88 C9.1
N$51
  Bottom 0.2: IC4.1 88.81,28.8 88.25,28.25 87.05,28.25 C10.1
N$52
  Bottom 0.2: IC4.3 88.84,31.34 87.75,30.25 87.05,30.25 C10.2
N$53
  Bottom 0.2: IC4.4 88.36,32.62 88,32.25 87.05,32.25 C9.2
N$54
  Bottom 0.2: IC4.8 90.08,40.33 91.5,41.75 93.25,41.75 94,42.5 R24.1
RESET
  Bottom 0.254: IC1.29 48.85,40.35 47.05,38.55 Q1.A 46.39,36.09 C3.1 42.56,33.36 JP1.12 | Q1.A' 51.68,35.96 R6.1
  Bottom 0.305: Q1.A 47.65,36.03 50.3,36.03 50.9,35.43 Q1.A'
RST
  Bottom 0.2: SV1.5 80.54,50.71 84,47.25 R14.2
RXD  (via drill 0.5)
  Top 0.254: FTDI.4 43.38,35.27 43.38,37.3 v43,37.68
  Bottom 0.18: IC1.30 48.35,40.8 45.7,38.15 43.48,38.15 v43,37.68
  Bottom 0.2: FTDI.4 47.75,30.74 47.75,28 48.41,27.34 58.09,27.34 60.75,30 66,30 68.75,27.25 79.75,27.25 D7.A 81.92,27.34 R25.1 82.08,27.34 D8.A
  Bottom 0.254: v43,37.68 41.48,36.15 JP1.11
SCK
  Bottom 0.2: SV1.3 78,50 80,48 R13.2
TXD
  Top 0.254: FTDI.5 42.88,33.23 42.88,36.41 41.48,37.8 JP1.10
  Bottom 0.18: IC1.31 47.85,40.9 45.6,38.65 41.69,38.65 JP1.10
  Bottom 0.2: R20.1 96,41 97.75,39.25 97.75,37 97.17,36.42 IC4.10 93.67,36.42 93.25,36 93.25,25.5 93,25.25 91.25,25.25 90.25,26.25 78.5,26.25 78,26.75 68.5,26.75 65.75,29.5 61,29.5 58.25,26.75 46.5,26.75 45.25,28 45.25,30.78 FTDI.5
VBAT  (via drill 0.5)
  Top 0.6: S1.5 87.75,4.25 86.5,5.5 83.5,5.5 79,10 79,15.5 71.75,22.75 52,22.75 48.25,26.5 39.5,26.5 38,28 38,59.75 39.5,61.25 41.43,61.25 JP1.1 42.2,61.3 43.75,59.75 47.56,59.75 v49.6,57.7
  Bottom 0.406: D3.A 52.24,56.72 51.8,57.15 50.3,57.65 49.9,57.65 v49.6,57.7
VBUS  (via drill 0.5, 0.8)
  Top 0.25: 43.9,38 43.89,37.99
  Top 0.3: 43.9,38 43.9,40.15 43.5,40.55 43.5,49.65 43.7,49.95 43.7,50.85 42.7,51.85 42.7,54.25 41.6,55.35 41.6,56.1 JP1.3
  Top 0.305: FTDI.3 48.85,32.34 47.58,32.34 43.89,36.03 43.89,37.99
  Top 0.4: v44.72,56.71 41.97,56.71 JP1.3
  Top 0.6: v62.25,26.25 52.25,26.25 50.5,28 50.5,30.69 FTDI.3
  Bottom 0.4: X1.VBUS 47.8,57.85 46.7,56.75 46.27,56.75 D2.A 45.56,56.66 v44.72,56.71
  Bottom 0.406: 46.24,56.73 D2.A
  Bottom 0.6: v62.25,26.25 64,24.25 64,20.5 64.5,20 64.5,17.96 U$6.4
VCC
  Bottom 0.2: R10.2 82,47.25 79.5,49.75 79.5,52.25 78.5,53.25 76.73,53.25 SV1.2

### Text on the board
Bottom: Pavapro - http://jaromir.xf.cz/